# EAGLE design 64-pinHTSSOP (EAGLE 9.6.2)
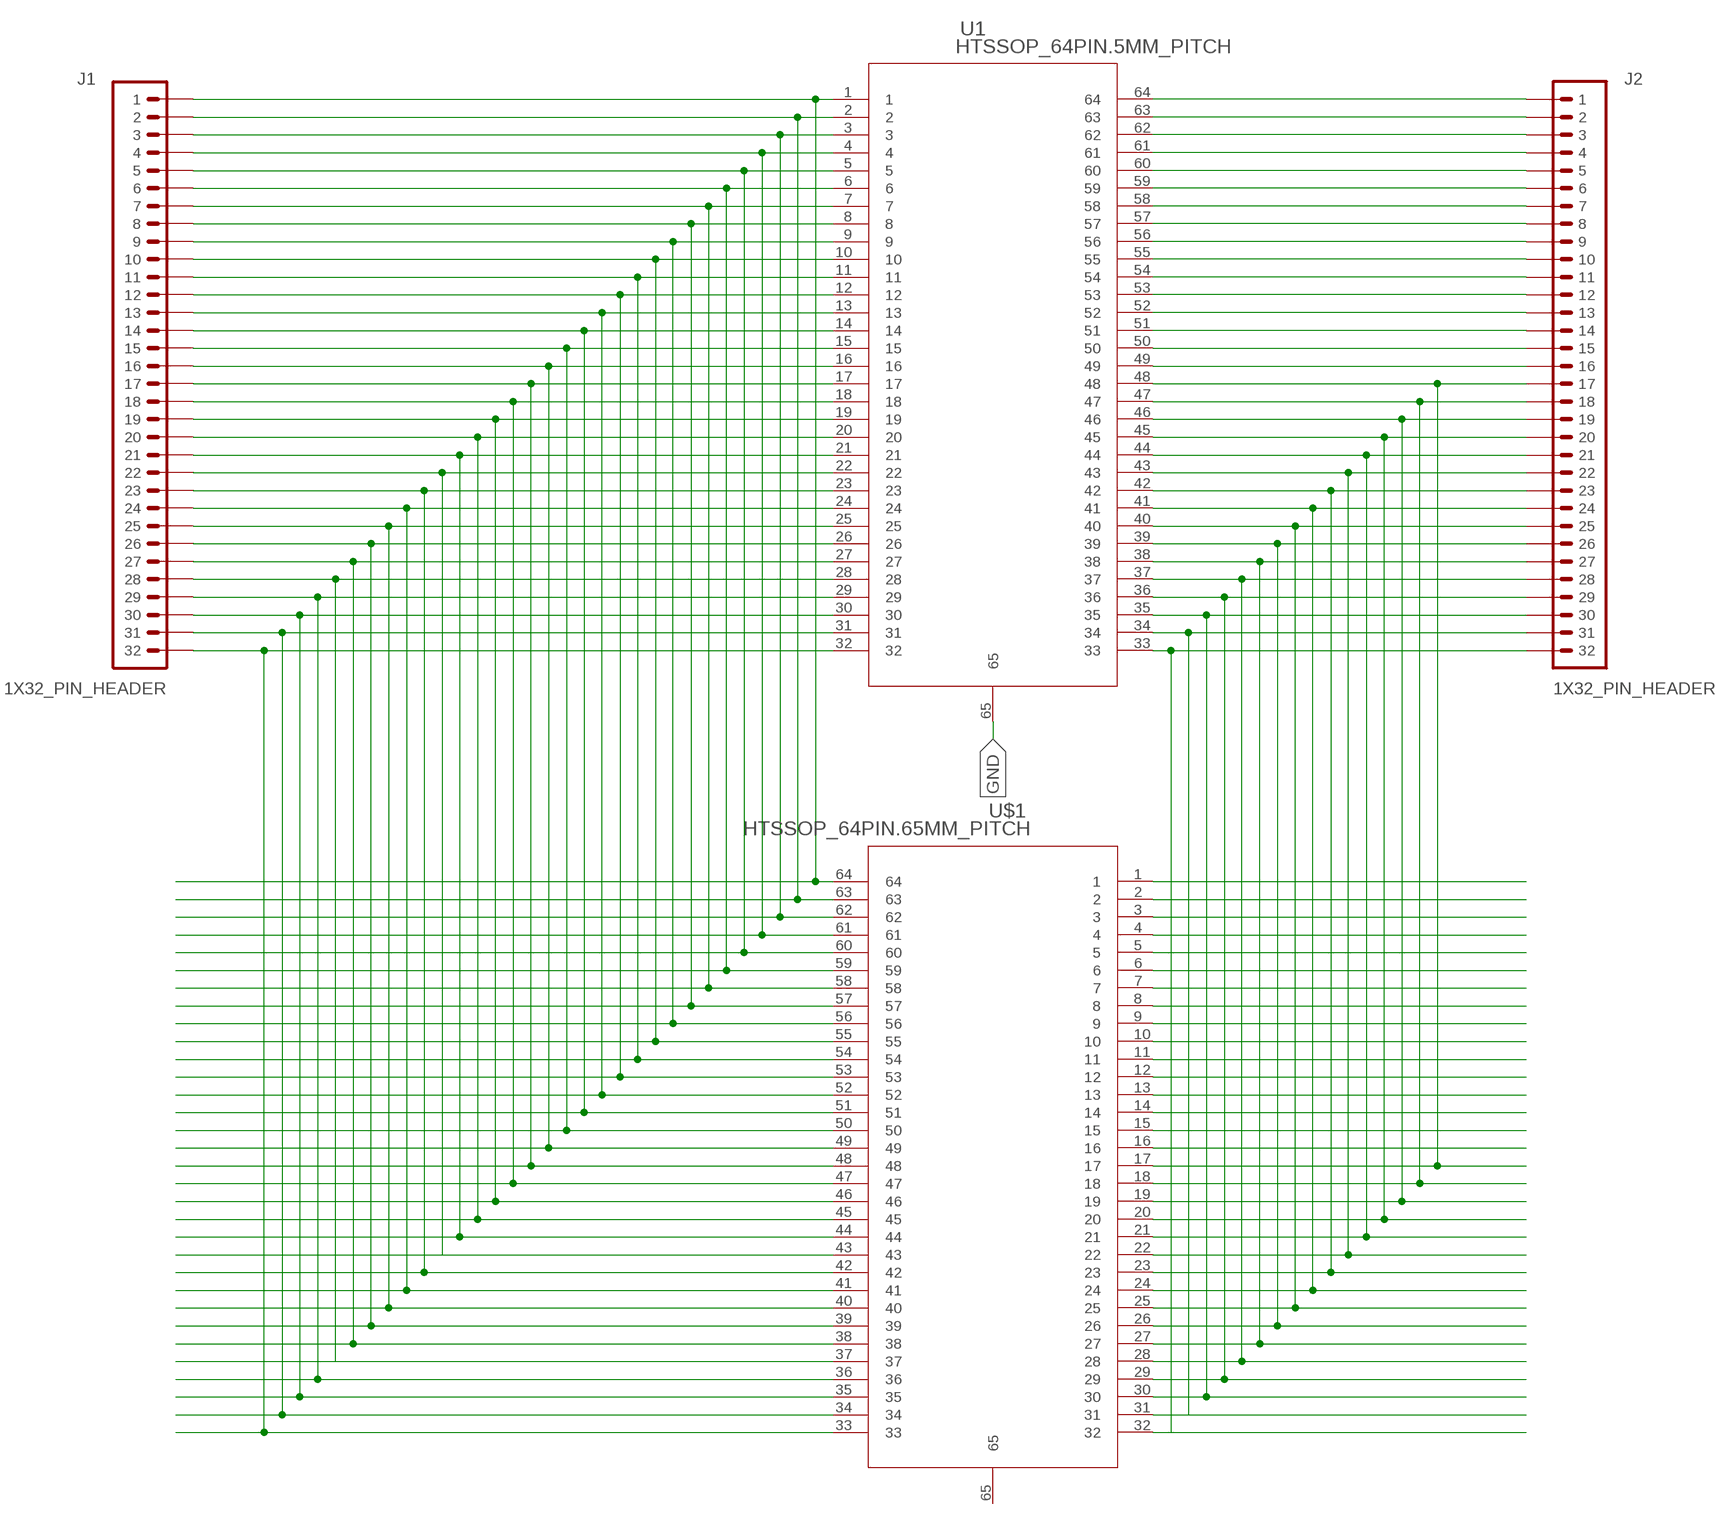
[diagram p0: schematic, sheet 1]

## Parts
J1  1X32_PIN_HEADER  [1X32PIN]
J2  1X32_PIN_HEADER  [1X32PIN]
U1  HTSSOP_64PIN.5MM_PITCH  [HTSSOP_64PIN_.5MM]
U$1  HTSSOP_64PIN.65MM_PITCH  [HTSSOP_64PIN_.65MM]

## Nets
GND: U1.65
N$1: J1.1 U1.1 U$1.64
N$2: J1.2 U1.2 U$1.63
N$3: J1.3 U1.3 U$1.62
N$4: J1.4 U1.4 U$1.61
N$5: J1.5 U1.5 U$1.60
N$7: J1.7 U1.7 U$1.58
N$8: J1.8 U1.8 U$1.57
N$10: J1.10 U1.10 U$1.55
N$11: J1.11 U1.11 U$1.54
N$12: J1.12 U1.12 U$1.53
N$13: J1.15 U1.15 U$1.50
N$14: J1.14 U1.14 U$1.51
N$15: J2.1 U1.64
N$16: J2.2 U1.63
N$17: J2.3 U1.62
N$18: J2.4 U1.61
N$19: J2.5 U1.60
N$20: J2.6 U1.59
N$21: J2.7 U1.58
N$22: J2.8 U1.57
N$23: J2.9 U1.56
N$24: J2.10 U1.55
N$25: J2.11 U1.54
N$26: J2.12 U1.53
N$27: J2.13 U1.52
N$28: J2.14 U1.51
N$30: J1.16 U1.16 U$1.49
N$32: J1.18 U1.18 U$1.47
N$34: J1.20 U1.20 U$1.45
N$35: J1.21 U1.21 U$1.44
N$36: J1.22 U1.22 U$1.43
N$37: J1.23 U1.23 U$1.42
N$38: J1.24 U1.24 U$1.41
N$39: J1.25 U1.25 U$1.40
N$41: J1.27 U1.27 U$1.38
N$43: J1.29 U1.29 U$1.36
N$44: J1.30 U1.30 U$1.35
N$45: J2.15 U1.50
N$46: J2.16 U1.49
N$47: J2.17 U1.48 U$1.17
N$49: J2.19 U1.46 U$1.19
N$51: J2.21 U1.44 U$1.21
N$53: J2.23 U1.42 U$1.23
N$56: J2.26 U1.39 U$1.26
N$59: J2.29 U1.36 U$1.29
N$60: J2.30 U1.35 U$1.30
N$61: J2.31 U1.34 U$1.31
N$62: J2.32 U1.33 U$1.32
N$63: J1.31 U1.31 U$1.34
N$116: J1.6 U1.6 U$1.59
N$119: J1.9 U1.9 U$1.56
N$124: J1.13 U1.13 U$1.52
N$127: J1.17 U1.17 U$1.48
N$129: J1.19 U1.19 U$1.46
N$136: J1.26 U1.26 U$1.39
N$138: J1.28 U1.28 U$1.37
N$142: J1.32 U1.32 U$1.33
N$143: U$1.1
N$144: U$1.2
N$145: U$1.3
N$146: U$1.4
N$147: U$1.5
N$148: U$1.6
N$149: U$1.7
N$150: U$1.8
N$151: U$1.9
N$152: U$1.10
N$153: U$1.11
N$154: U$1.12
N$155: U$1.14
N$156: U$1.13
N$157: U$1.15
N$158: U$1.16
N$160: J2.18 U1.47 U$1.18
N$162: J2.20 U1.45 U$1.20
N$164: J2.22 U1.43 U$1.22
N$166: J2.24 U1.41 U$1.24
N$167: J2.25 U1.40 U$1.25
N$169: J2.27 U1.38 U$1.27
N$170: J2.28 U1.37 U$1.28
Unconnected: U$1.65

## Library data of the parts
J1 J2 = 64HTSSOP:1X32_PIN_HEADER
U1 U$1 = 64HTSSOP:HTSSOP_64PIN

## Board
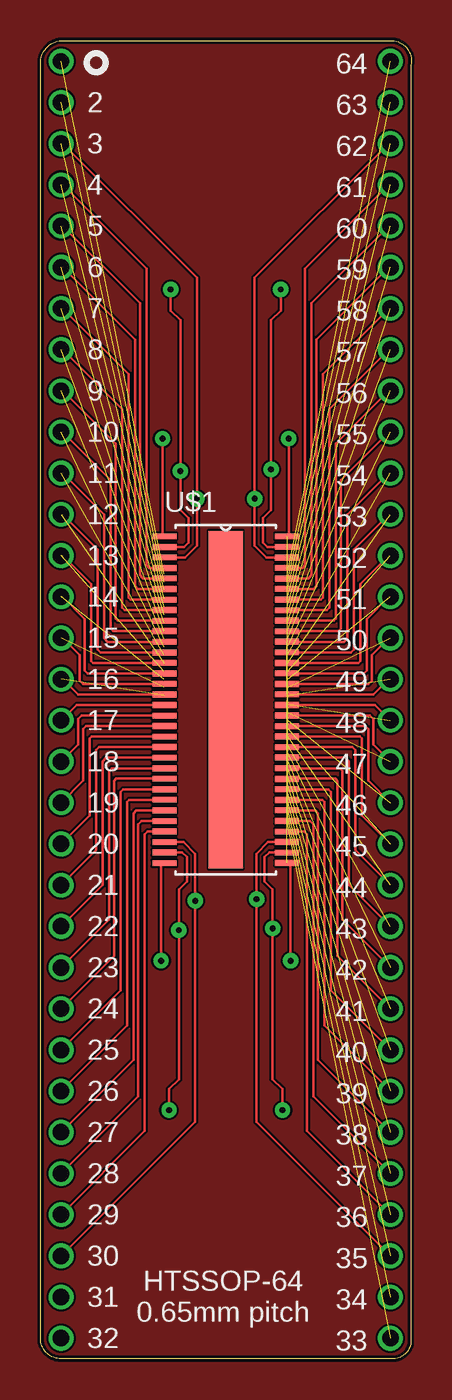
[diagram p1: board, top side]
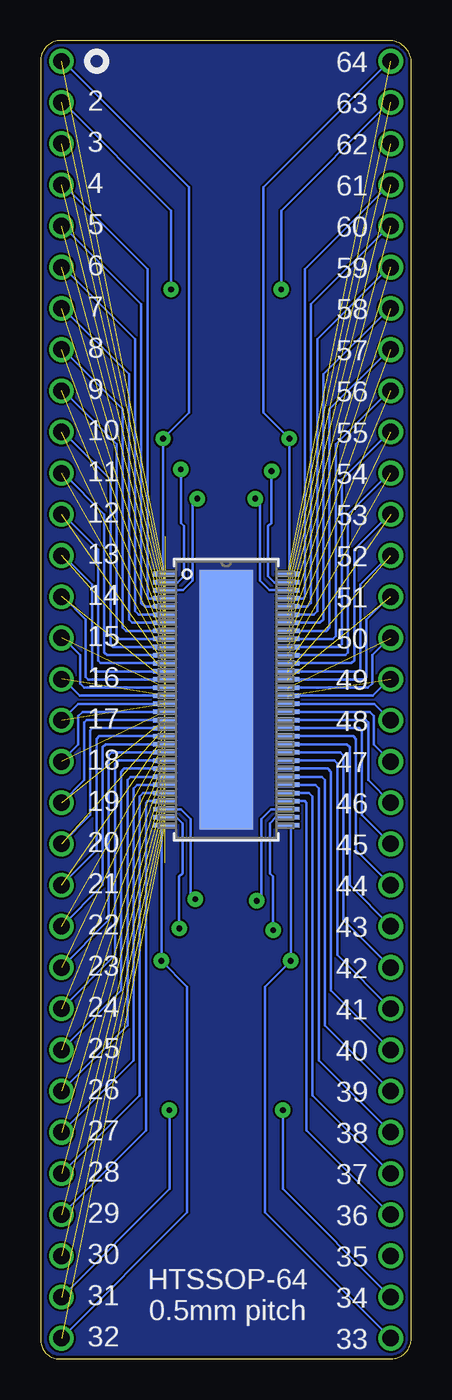
[diagram p2: board, bottom side, seen from below]

Size 22.89 x 81.29 mm. Coordinates in mm from the lower left corner, seen from the top.
Outline: 0,80.02 arc-90 1.52,81.29 21.84,81.29 arc-90 22.86,79.76 22.86,1.02 arc-90 21.59,0.01 1.27,0.01 arc-90 0,1.28 0,80.02
Copper layers (1*16): Top 0.035mm / dielectric 1.6mm / Bottom 0.035mm
Design rules "designrulecheck_jlcpcb_2layers": minimum track width 5mil, minimum drill 0.3mm, track to track 5mil, track to pad 0.2mm, pad to pad 5mil, via to via 10mil, smd to smd 5mil, copper to edge 0.2mm, drill to drill 0.5mm, minimum pad ring 10mil, minimum via ring 0.3mm, stop-mask expansion 4mil, vias tented up to drill 0mil, thermal gap 10mil

### Footprints (pad centres in the part's own frame; a part is rotated, then mirrored left to right if it is on the bottom)
1X32PIN = drill 1.016 pad 1.524: 1 0,0; 2 -2.54,0; 3 -5.08,0; 4 -7.62,0; 5 -10.16,0; 6 -12.7,0; 7 -15.24,0; 8 -17.78,0; 9 -20.32,0; 10 -22.86,0; 11 -25.4,0; 12 -27.94,0; 13 -30.48,0; 14 -33.02,0; 15 -35.56,0; 16 -38.1,0; 17 -40.64,0; 18 -43.18,0; 19 -45.72,0; 20 -48.26,0; 21 -50.8,0; 22 -53.34,0; 23 -55.88,0; 24 -58.42,0; 25 -60.96,0; 26 -63.5,0; 27 -66.04,0; 28 -68.58,0; 29 -71.12,0; 30 -73.66,0; 31 -76.2,0; 32 -78.74,0
HTSSOP_64PIN_.5MM = smd 1.41 x 0.279: 1 -3.804,7.75; 2 -3.804,7.25; 3 -3.804,6.75; 4 -3.804,6.25; 5 -3.804,5.75; 6 -3.804,5.25; 7 -3.804,4.75; 8 -3.804,4.25; 9 -3.804,3.75; 10 -3.804,3.25; 11 -3.804,2.75; 12 -3.804,2.25; 13 -3.804,1.75; 14 -3.804,1.25; 15 -3.804,0.75; 16 -3.804,0.25; 17 -3.804,-0.25; 18 -3.804,-0.75; 19 -3.804,-1.25; 20 -3.804,-1.75; 21 -3.804,-2.25; 22 -3.804,-2.75; 23 -3.804,-3.25; 24 -3.804,-3.75; 25 -3.804,-4.25; 26 -3.804,-4.75; 27 -3.804,-5.25; 28 -3.804,-5.75; 29 -3.804,-6.25; 30 -3.804,-6.75; 31 -3.804,-7.25; 32 -3.804,-7.75; 33 3.804,-7.75; 34 3.804,-7.25; 35 3.804,-6.75; 36 3.804,-6.25; 37 3.804,-5.75; 38 3.804,-5.25; 39 3.804,-4.75; 40 3.804,-4.25; 41 3.804,-3.75; 42 3.804,-3.25; 43 3.804,-2.75; 44 3.804,-2.25; 45 3.804,-1.75; 46 3.804,-1.25; 47 3.804,-0.75; 48 3.804,-0.25; 49 3.804,0.25; 50 3.804,0.75; 51 3.804,1.25; 52 3.804,1.75; 53 3.804,2.25; 54 3.804,2.75; 55 3.804,3.25; 56 3.804,3.75; 57 3.804,4.25; 58 3.804,4.75; 59 3.804,5.25; 60 3.804,5.75; 61 3.804,6.25; 62 3.804,6.75; 63 3.804,7.25; 64 3.804,7.75 | smd 3.28 x 16: 65 0,0
HTSSOP_64PIN_.65MM = smd 1.473 x 0.356: 1 -3.785,10.077; 2 -3.785,9.416; 3 -3.785,8.781; 4 -3.785,8.121; 5 -3.785,7.486; 6 -3.785,6.826; 7 -3.785,6.165; 8 -3.785,5.53; 9 -3.785,4.87; 10 -3.785,4.235; 11 -3.785,3.574; 12 -3.785,2.914; 13 -3.785,2.279; 14 -3.785,1.619; 15 -3.785,0.984; 16 -3.785,0.323; 17 -3.785,-0.323; 18 -3.785,-0.984; 19 -3.785,-1.619; 20 -3.785,-2.279; 21 -3.785,-2.914; 22 -3.785,-3.574; 23 -3.785,-4.235; 24 -3.785,-4.87; 25 -3.785,-5.53; 26 -3.785,-6.165; 27 -3.785,-6.826; 28 -3.785,-7.486; 29 -3.785,-8.121; 30 -3.785,-8.781; 31 -3.785,-9.416; 32 -3.785,-10.077; 33 3.775,10.077; 34 3.775,9.427; 35 3.775,8.766; 36 3.775,8.131; 37 3.775,7.471; 38 3.775,6.836; 39 3.775,6.176; 40 3.775,5.515; 41 3.775,4.88; 42 3.775,4.22; 43 3.775,3.585; 44 3.775,2.924; 45 3.775,2.264; 46 3.775,1.629; 47 3.775,0.969; 48 3.775,0.334; 49 3.775,-0.327; 50 3.775,-0.973; 51 3.775,-1.634; 52 3.775,-2.269; 53 3.775,-2.929; 54 3.775,-3.564; 55 3.775,-4.224; 56 3.775,-4.885; 57 3.775,-5.52; 58 3.775,-6.18; 59 3.775,-6.815; 60 3.775,-7.476; 61 3.775,-8.136; 62 3.775,-8.771; 63 3.775,-9.431; 64 3.775,-10.066 | smd 2.108 x 20.81: 65 0,0

### Placement (x,y rotation side)
J1  21.59,80.02 90 top
J2  1.27,80.02 90 top
U1  11.43,40.65 0 bottom
U$1  11.43,40.65 0 top

### Tracks (layer width: path | path; a pad name or v marks a point on that pad's centre or on a via)
GND
  pour Top: -8.89,91.45 31.75,91.45 31.75,-5.07 -8.89,-5.07
  pour Bottom (no thermals): -6.35,93.99 34.29,93.99 34.29,-7.61 -8.89,-7.61 -8.89,93.99
N$1  (2 unrouted)
N$2  (2 unrouted)
N$3  (2 unrouted)
N$4  (2 unrouted)
N$5  (2 unrouted)
N$7  (2 unrouted)
N$8  (2 unrouted)
N$10  (2 unrouted)
N$11  (2 unrouted)
N$12  (2 unrouted)
N$13  (2 unrouted)
N$14  (2 unrouted)
N$15  (1 unrouted)
N$16  (1 unrouted)
N$17  (1 unrouted)
N$18  (1 unrouted)
N$19  (1 unrouted)
N$20  (1 unrouted)
N$21  (1 unrouted)
N$22  (1 unrouted)
N$23  (1 unrouted)
N$24  (1 unrouted)
N$25  (1 unrouted)
N$26  (1 unrouted)
N$27  (1 unrouted)
N$28  (1 unrouted)
N$30  (2 unrouted)
N$32  (2 unrouted)
N$34  (2 unrouted)
N$35  (2 unrouted)
N$36  (2 unrouted)
N$37  (2 unrouted)
N$38  (2 unrouted)
N$39  (2 unrouted)
N$41  (2 unrouted)
N$43  (2 unrouted)
N$44  (2 unrouted)
N$45  (1 unrouted)
N$46  (1 unrouted)
N$47
  Top 0.152: J2.17 2.22,40.32 U$1.17
  Bottom 0.152: U1.48 2.29,40.4 J2.17
N$48  (1 unrouted)
  Top 0.152: 21.49,41.92 20.54,40.97 15.12,40.97
  Bottom 0.152: 15.13,40.9 20.47,40.9 21.49,41.92
N$49
  Top 0.152: U$1.19 2.81,39.03 2.63,38.85 2.63,35.66 J2.19
  Bottom 0.152: U1.46 2.81,39.4 2.67,39.25 2.67,35.69 J2.19
N$50  (1 unrouted)
  Top 0.152: 15.12,42.27 19.95,42.27 20.13,42.45 20.13,45.64 21.49,47
  Bottom 0.152: 15.13,41.9 19.95,41.9 20.09,42.04 20.09,45.6 21.49,47
N$51
  Top 0.152: U$1.21 3.62,37.73 3.43,37.55 3.43,31.38 J2.21
  Bottom 0.152: U1.44 3.59,38.4 3.43,38.23 3.43,31.38 J2.21
N$52  (1 unrouted)
  Top 0.152: 15.12,43.56 19.14,43.56 19.33,43.75 19.33,49.92 21.49,52.08
  Bottom 0.152: 15.13,42.9 19.17,42.9 19.33,43.06 19.33,49.92 21.49,52.08
N$53
  Top 0.152: U$1.23 4.39,36.41 4.23,36.25 4.23,27.1 J2.23
  Bottom 0.152: U1.42 4.37,37.4 4.19,37.22 4.19,27.06 J2.23
N$54  (1 unrouted)
  Top 0.152: 15.12,44.88 18.36,44.88 18.53,45.05 18.53,54.2 21.49,57.16
  Bottom 0.152: 15.13,43.9 18.39,43.9 18.57,44.08 18.57,54.24 21.49,57.16
N$55  (1 unrouted)
  Top 0.152: 15.12,46.81 17.3,46.81 17.43,46.95 17.43,60.72 21.49,64.78
  Bottom 0.152: 15.13,45.4 17.22,45.4 17.43,45.6 17.43,60.71 21.49,64.78
N$56
  Top 0.152: U$1.26 5.46,34.48 5.33,34.35 5.33,20.58 J2.26
  Bottom 0.152: U1.39 5.54,35.9 5.33,35.69 5.33,20.58 J2.26
N$57  (1 unrouted)
  Top 0.152: 15.12,48.77 16.15,48.77 16.33,48.95 16.33,67.24 21.49,72.4
  Bottom 0.152: 15.13,46.9 16.18,46.9 16.28,47 16.28,67.19 21.49,72.4
N$58  (via drill 0.35)
  Top 0.152: 15.12,49.43 13.95,49.43 13.22,50.16 13.22,52.95 v13.22,53.05 13.22,66.66 21.49,74.94
  Bottom 0.152: 15.13,47.4 14.11,47.4 13.52,47.99 13.52,52.75 v13.22,53.05
N$59
  Top 0.152: U$1.29 6.61,32.53 6.43,32.35 6.43,14.06 J2.29
  Bottom 0.152: U1.36 6.58,34.4 6.48,34.3 6.48,14.1 J2.29
N$60  (via drill 0.35)
  Top 0.152: U$1.30 8.81,31.87 9.54,31.13 9.54,28.35 v9.54,28.25 9.54,14.63 J2.30
  Bottom 0.152: U1.35 8.65,33.9 9.24,33.31 9.24,28.55 v9.54,28.25
N$61  (via drill 0.35)
  Top 0.152: U$1.31 8.75,31.23 9.03,30.95 9.03,29.45 8.54,28.95 v8.54,26.45 8.54,17.25 7.93,16.65 v7.93,15.35
  Bottom 0.152: U1.34 7.64,33.41 8.35,33.41 8.74,33.02 8.74,29.95 8.54,29.75 v8.54,26.45 | v7.93,15.35 7.93,10.48 J2.31
N$62  (via drill 0.35)
  Top 0.152: U$1.32 7.44,30.36 v7.44,24.55
  Bottom 0.152: U1.33 7.44,32.71 v7.44,24.55 9.03,22.96 9.03,9.04 J2.32
N$63  (2 unrouted)
N$65  (via drill 0.35)
  Top 0.152: 15.12,50.06 14.01,50.06 13.73,50.35 13.73,51.85 14.22,52.34 v14.22,54.85 14.22,64.04 14.83,64.65 v14.83,65.95
  Bottom 0.152: 15.13,47.9 15.12,47.88 14.41,47.88 14.02,48.27 14.02,51.35 14.22,51.55 v14.22,54.85 | v14.83,65.95 14.83,70.82 21.49,77.48
N$66  (via drill 0.35)
  Top 0.152: 15.12,50.72 15.32,50.93 v15.32,56.75
  Bottom 0.152: 15.13,48.4 15.32,48.58 v15.32,56.75 13.73,58.34 13.73,72.26 21.49,80.02
N$67  (1 unrouted)
  Top 0.152: 15.12,41.63 20.21,41.63 20.43,41.85 20.43,43.4 21.49,44.46
  Bottom 0.152: 15.13,41.4 20.19,41.4 20.45,41.66 20.45,43.42 21.49,44.46
N$68  (1 unrouted)
  Top 0.152: 15.12,42.93 19.61,42.93 19.73,43.05 19.73,47.78 21.49,49.54
  Bottom 0.152: 15.13,42.4 19.56,42.4 19.71,42.55 19.71,47.76 21.49,49.54
N$69  (1 unrouted)
  Top 0.152: 15.12,44.22 18.7,44.22 18.93,44.45 18.93,52.06 21.49,54.62
  Bottom 0.152: 15.13,43.4 18.78,43.4 18.95,43.57 18.95,52.08 21.49,54.62
N$70  (1 unrouted)
  Top 0.152: 15.12,45.52 18.1,45.52 18.23,45.65 18.23,56.44 21.49,59.7
  Bottom 0.152: 15.13,44.4 18,44.4 18.19,44.58 18.19,56.39 21.49,59.7
N$71  (1 unrouted)
  Top 0.152: 15.12,46.18 17.66,46.18 17.83,46.35 17.83,58.58 21.49,62.24
  Bottom 0.152: 15.13,44.9 17.61,44.9 17.81,45.09 17.81,58.55 21.49,62.24
N$72  (1 unrouted)
  Top 0.152: 15.12,47.47 16.86,47.47 17.03,47.65 17.03,62.86 21.49,67.32
  Bottom 0.152: 15.13,45.9 16.83,45.9 17.05,46.11 17.05,62.87 21.49,67.32
N$73  (1 unrouted)
  Top 0.152: 15.12,48.13 16.52,48.13 16.73,48.35 16.73,65.1 21.49,69.86
  Bottom 0.152: 15.13,46.4 16.45,46.4 16.66,46.62 16.66,65.03 21.49,69.86
N$74  (1 unrouted)
  Top 0.152: 21.59,39.38 20.64,40.32 15.21,40.32
  Bottom 0.152: 15.23,40.4 20.57,40.4 21.59,39.38
N$75  (1 unrouted)
  Top 0.152: 15.21,39.03 20.05,39.03 20.23,38.85 20.23,35.66 21.59,34.3
  Bottom 0.152: 15.23,39.4 20.05,39.4 20.19,39.25 20.19,35.69 21.59,34.3
N$76  (1 unrouted)
  Top 0.152: 15.21,37.73 19.24,37.73 19.43,37.55 19.43,31.38 21.59,29.22
  Bottom 0.152: 15.23,38.4 19.27,38.4 19.43,38.23 19.43,31.38 21.59,29.22
N$77  (1 unrouted)
  Top 0.152: 15.21,36.41 18.46,36.41 18.63,36.25 18.63,27.1 21.59,24.14
  Bottom 0.152: 15.23,37.4 18.49,37.4 18.67,37.22 18.67,27.06 21.59,24.14
N$78  (1 unrouted)
  Top 0.152: 15.21,34.48 17.39,34.48 17.53,34.35 17.53,20.58 21.59,16.52
  Bottom 0.152: 15.23,35.9 17.32,35.9 17.53,35.69 17.53,20.58 21.59,16.52
N$79  (1 unrouted)
  Top 0.152: 15.21,32.53 16.25,32.53 16.43,32.35 16.43,14.06 21.59,8.9
  Bottom 0.152: 15.23,34.4 16.28,34.4 16.38,34.3 16.38,14.1 21.59,8.9
N$80
  Top 0.152: 15.21,31.87 14.05,31.87 13.32,31.13 13.32,14.63 21.59,6.36
N$82
  Bottom 0.152: 15.23,32.9 15.42,32.71 15.42,24.55 13.83,22.96 13.83,9.04 21.59,1.28
N$83  (1 unrouted)
  Top 0.152: 15.21,39.66 20.31,39.66 20.53,39.45 20.53,37.9 21.59,36.84
  Bottom 0.152: 15.23,39.9 20.29,39.9 20.55,39.63 20.55,37.87 21.59,36.84
N$84  (1 unrouted)
  Top 0.152: 15.21,38.37 19.71,38.37 19.83,38.25 19.83,33.52 21.59,31.76
  Bottom 0.152: 15.23,38.9 19.66,38.9 19.81,38.74 19.81,33.53 21.59,31.76
N$85  (1 unrouted)
  Top 0.152: 15.21,37.07 18.8,37.07 19.03,36.85 19.03,29.24 21.59,26.68
  Bottom 0.152: 15.23,37.9 18.88,37.9 19.05,37.73 19.05,29.22 21.59,26.68
N$86  (1 unrouted)
  Top 0.152: 15.21,35.78 18.2,35.78 18.33,35.65 18.33,24.86 21.59,21.6
  Bottom 0.152: 15.23,36.9 18.1,36.9 18.29,36.71 18.29,24.9 21.59,21.6
N$87  (1 unrouted)
  Top 0.152: 15.21,35.12 17.76,35.12 17.93,34.95 17.93,22.72 21.59,19.06
  Bottom 0.152: 15.23,36.4 17.71,36.4 17.91,36.2 17.91,22.74 21.59,19.06
N$88  (1 unrouted)
  Top 0.152: 15.21,33.82 16.96,33.82 17.13,33.65 17.13,18.44 21.59,13.98
  Bottom 0.152: 15.23,35.4 16.93,35.4 17.14,35.19 17.14,18.42 21.59,13.98
N$89  (1 unrouted)
  Top 0.152: 15.21,33.16 16.62,33.16 16.83,32.95 16.83,16.2 21.59,11.44
  Bottom 0.152: 15.23,34.9 16.55,34.9 16.76,34.68 16.76,16.26 21.59,11.44
N$90  (1 unrouted)
  Top 0.152: 1.37,41.92 2.32,40.97 7.74,40.97
  Bottom 0.152: 7.73,40.9 2.39,40.9 1.37,41.92
N$91  (1 unrouted)
  Top 0.152: 7.74,42.27 2.91,42.27 2.73,42.45 2.73,45.64 1.37,47
  Bottom 0.152: 7.73,41.9 2.91,41.9 2.77,42.04 2.77,45.6 1.37,47
N$92  (1 unrouted)
  Top 0.152: 7.74,43.56 3.72,43.56 3.53,43.75 3.53,49.92 1.37,52.08
  Bottom 0.152: 7.73,42.9 3.69,42.9 3.53,43.06 3.53,49.92 1.37,52.08
N$93  (1 unrouted)
  Top 0.152: 7.74,44.88 4.5,44.88 4.33,45.05 4.33,54.2 1.37,57.16
  Bottom 0.152: 7.73,43.9 4.47,43.9 4.29,44.08 4.29,54.24 1.37,57.16
N$94  (1 unrouted)
  Top 0.152: 7.74,46.81 5.56,46.81 5.43,46.95 5.43,60.72 1.37,64.78
  Bottom 0.152: 7.73,45.4 5.64,45.4 5.43,45.6 5.43,60.71 1.37,64.78
N$95  (1 unrouted)
  Top 0.152: 7.74,48.77 6.71,48.77 6.53,48.95 6.53,67.24 1.37,72.4
  Bottom 0.152: 7.73,46.9 6.68,46.9 6.58,47 6.58,67.19 1.37,72.4
N$96
  Top 0.152: 7.74,49.43 8.91,49.43 9.64,50.16 9.64,66.66 1.37,74.94
N$98
  Bottom 0.152: 7.73,48.4 7.54,48.58 7.54,56.75 9.13,58.34 9.13,72.26 1.37,80.02
N$99  (1 unrouted)
  Top 0.152: 7.74,41.63 2.65,41.63 2.43,41.85 2.43,43.4 1.37,44.46
  Bottom 0.152: 7.73,41.4 2.67,41.4 2.41,41.66 2.41,43.42 1.37,44.46
N$100  (1 unrouted)
  Top 0.152: 7.74,42.93 3.25,42.93 3.13,43.05 3.13,47.78 1.37,49.54
  Bottom 0.152: 7.73,42.4 3.3,42.4 3.15,42.55 3.15,47.76 1.37,49.54
N$101  (1 unrouted)
  Top 0.152: 7.74,44.22 4.16,44.22 3.93,44.45 3.93,52.06 1.37,54.62
  Bottom 0.152: 7.73,43.4 4.08,43.4 3.91,43.57 3.91,52.08 1.37,54.62
N$102  (1 unrouted)
  Top 0.152: 7.74,45.52 4.76,45.52 4.63,45.65 4.63,56.44 1.37,59.7
  Bottom 0.152: 7.73,44.4 4.86,44.4 4.67,44.58 4.67,56.39 1.37,59.7
N$103  (1 unrouted)
  Top 0.152: 7.74,46.18 5.2,46.18 5.03,46.35 5.03,58.58 1.37,62.24
  Bottom 0.152: 7.73,44.9 5.25,44.9 5.05,45.09 5.05,58.55 1.37,62.24
N$104  (1 unrouted)
  Top 0.152: 7.74,47.47 6,47.47 5.83,47.65 5.83,62.86 1.37,67.32
  Bottom 0.152: 7.73,45.9 6.03,45.9 5.81,46.11 5.81,62.87 1.37,67.32
N$105  (1 unrouted)
  Top 0.152: 7.74,48.13 6.34,48.13 6.13,48.35 6.13,65.1 1.37,69.86
  Bottom 0.152: 7.73,46.4 6.42,46.4 6.2,46.62 6.2,65.03 1.37,69.86
N$106
  Bottom 0.152: 15.23,33.9 14.21,33.9 13.62,33.31 13.62,28.55 13.32,28.25
N$107
  Bottom 0.152: 15.23,33.4 15.22,33.41 14.51,33.41 14.12,33.02 14.12,29.95 14.32,29.75 14.32,26.45
N$108  (via drill 0.35)
  Top 0.152: 15.21,31.23 14.11,31.23 13.83,30.95 13.83,29.45 14.32,28.95 14.32,17.25 14.93,16.65 v14.93,15.35
  Bottom 0.152: v14.93,15.35 14.93,10.48 21.59,3.82
N$109
  Top 0.152: 15.21,30.57 15.42,30.36 15.42,24.55
N$110
  Bottom 0.152: 9.64,53.05 9.34,52.75 9.34,47.99 8.75,47.4 7.73,47.4
N$116  (2 unrouted)
N$119  (2 unrouted)
N$124  (2 unrouted)
N$127  (2 unrouted)
N$129  (2 unrouted)
N$136  (2 unrouted)
N$138  (2 unrouted)
N$142  (2 unrouted)
N$159
  Bottom 0.152: 8.64,54.85 8.64,51.55 8.84,51.35 8.84,48.27 8.45,47.88 7.74,47.88 7.73,47.9
N$160
  Top 0.152: U$1.18 2.55,39.66 2.33,39.45 2.33,37.9 J2.18
  Bottom 0.152: U1.47 2.57,39.9 2.31,39.63 2.31,37.87 J2.18
N$161  (via drill 0.35)
  Top 0.152: 7.74,50.06 8.85,50.06 9.13,50.35 9.13,51.85 8.64,52.34 8.64,64.04 8.03,64.65 v8.03,65.95
  Bottom 0.152: 1.37,77.48 8.03,70.82 v8.03,65.95
N$162
  Top 0.152: U$1.20 3.15,38.37 3.03,38.25 3.03,33.52 J2.20
  Bottom 0.152: U1.45 3.2,38.9 3.05,38.74 3.05,33.53 J2.20
N$163
  Top 0.152: 7.54,56.75 7.54,50.93 7.74,50.72
N$164
  Top 0.152: U$1.22 4.06,37.07 3.83,36.85 3.83,29.24 J2.22
  Bottom 0.152: U1.43 3.98,37.9 3.81,37.73 3.81,29.22 J2.22
N$165  (via drill 0.35)
  other vias: 13.33,28.35
N$166
  Top 0.152: U$1.24 4.66,35.78 4.53,35.65 4.53,24.86 J2.24
  Bottom 0.152: U1.41 4.76,36.9 4.57,36.71 4.57,24.9 J2.24
N$167
  Top 0.152: U$1.25 5.1,35.12 4.93,34.95 4.93,22.72 J2.25
  Bottom 0.152: U1.40 5.15,36.4 4.95,36.2 4.95,22.74 J2.25
N$168  (via drill 0.35)
  other vias: 14.33,26.55
N$169
  Top 0.152: U$1.27 5.9,33.82 5.73,33.65 5.73,18.44 J2.27
  Bottom 0.152: U1.38 5.93,35.4 5.71,35.19 5.71,18.42 J2.27
N$170
  Top 0.152: U$1.28 6.24,33.16 6.03,32.95 6.03,16.2 J2.28
  Bottom 0.152: U1.37 6.31,34.9 6.1,34.68 6.1,16.26 J2.28
N$171  (via drill 0.35)
  other vias: 15.43,24.55
N$172  (via drill 0.35)
  other vias: 9.63,53.05
N$173  (via drill 0.35)
  other vias: 7.53,56.75
N$174  (via drill 0.35)
  other vias: 8.63,54.75

### Text on the board
tPlace: 64 | 63 | 2 | 62 | 3 | 61 | 4 | 60 | 5 | 59 | 6 | 58 | 7 | 57 | 8 | 56 | 9 | 55 | 10 | 54 | 11 | 53 | 12 | 52 | 13 | 51 | 14 | 50 | 15 | 49 | 16 | 48 | 17 | 47 | 18 | 46 | 19 | 45 | 20 | 44 | 21 | 43 | 22 | 42 | 23 | 41 | 24 | 40 | 25 | 39 | 26 | 38 | 27 | 37 | 28 | 36 | 29 | 35 | 30 | 34 | 31 | HTSSOP-64 / 0.65mm pitch | 33 | 32
bPlace: 64 | 63 | 2 | 62 | 3 | 61 | 4 | 60 | 5 | 59 | 6 | 58 | 7 | 57 | 8 | 56 | 9 | 55 | 10 | 54 | 11 | 53 | 12 | 52 | 13 | 51 | 14 | 50 | 15 | 49 | 16 | 48 | 17 | 47 | 18 | 46 | 19 | 45 | 20 | 44 | 21 | 43 | 22 | 42 | 23 | 41 | 24 | 40 | 25 | 39 | 26 | 38 | 27 | 37 | 28 | 36 | 29 | 35 | 30 | 34 | HTSSOP-64 / 0.5mm pitch | 31 | 33 | 32
tValues: SOIC-28
bValues: TSSOP-28